# EAGLE schematic Fyre-PPG-Module (EAGLE 9.6.2)
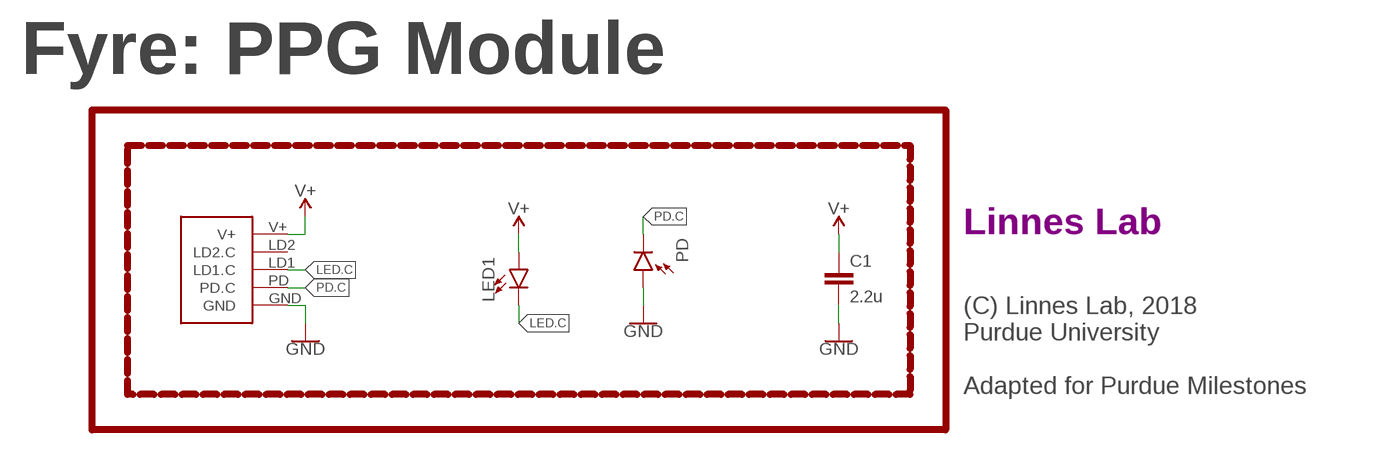
[diagram p0: schematic, sheet 1]

## Parts
C1  2.2u  CAPACITOR0603  [C0603]
J1  PPG.MODULE.2  [PPG.MODULE.2]
LED1  LED0805  [LED-0805]
PD  PHOTODIODE.-SMD.GULLWING  [2-SMD.GULLWING]
U$3  LINNES.LAB.LOGO  [LINNES.LAB.LOGO]

## Nets
GND: C1.2 J1.GND PD.+(A)
LED.C: J1.LD1(LD1.C) LED1.C
PD.C: J1.PD(PD.C) PD.-(C)
V+: C1.1 J1.V+ LED1.A
Unconnected: J1.LD2(LD2.C)

## Notes on the sheet
- Fyre: PPG Module
- (C) Linnes Lab, 2018
  Purdue University
  
  Adapted for Purdue Milestones

## Library data of the parts
C1 = CalvEngIO-Passives:CAPACITOR
J1 = LinnesLab-Connectors:PPG.MODULE.2: Digi-Key Part Number: S9014E-50-ND Manufacturer Part Number: GRPB501VWVN-RC Description: 1mm insulation height 0.05in pitch 50 positions
LED1 = LinnesLab-LED:LED: LED (Generic) Standard schematic elements and footprints for 5mm, 3mm, 1206, and 0603 sized LEDs. Generic LEDs with no color specified. LTST-C190KGKT: arrow indicates cathode
PD = CalvEngIO-Sensors:PHOTODIODE
U$3 = CalvEngIO-Logos:LINNES.LAB